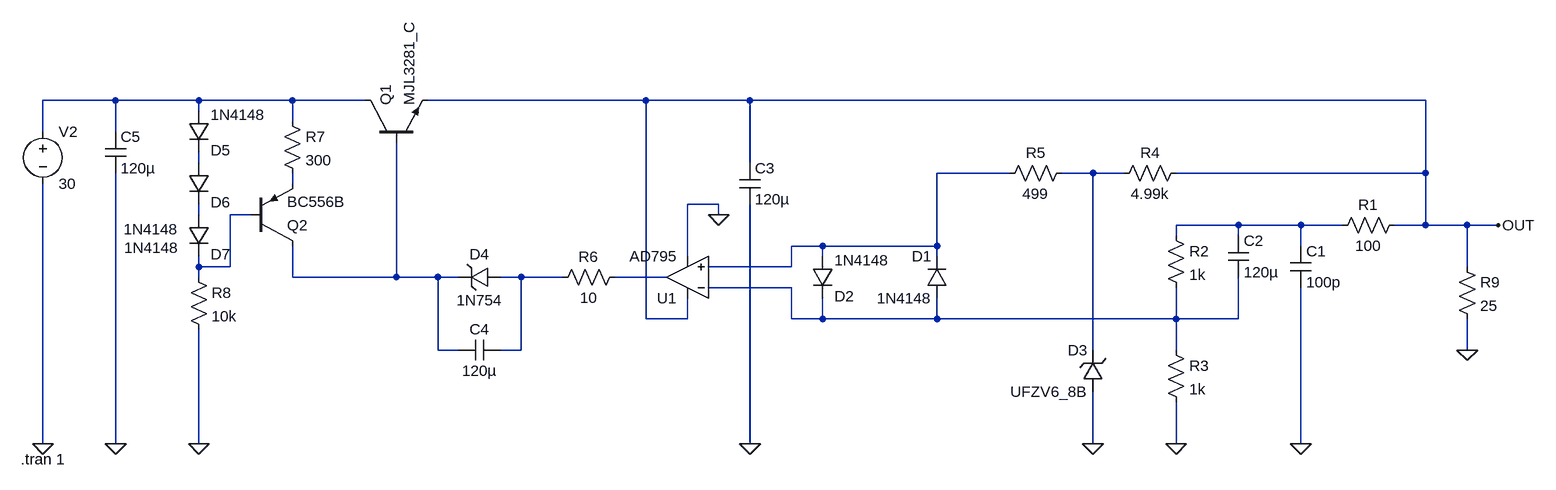
[diagram p0: schematic superreg.asc]
superreg.asc, the LTspice schematic file:
Version 4
SHEET 1 880 680
WIRE -1616 -96 -1728 -96
WIRE -1488 -96 -1616 -96
WIRE -1344 -96 -1488 -96
WIRE -1232 -96 -1344 -96
WIRE -800 -96 -1136 -96
WIRE -640 -96 -800 -96
WIRE 400 -96 -640 -96
WIRE -1488 -80 -1488 -96
WIRE -1344 -64 -1344 -96
WIRE -1728 -48 -1728 -96
WIRE -1616 -48 -1616 -96
WIRE -1488 0 -1488 -16
WIRE -640 0 -640 -96
WIRE -240 16 -352 16
WIRE -112 16 -160 16
WIRE -64 16 -112 16
WIRE 400 16 400 -96
WIRE 400 16 16 16
WIRE -1344 32 -1344 16
WIRE -688 64 -736 64
WIRE -1488 80 -1488 64
WIRE -1408 80 -1440 80
WIRE -688 80 -688 64
WIRE 112 96 16 96
WIRE 208 96 112 96
WIRE 272 96 208 96
WIRE 400 96 400 16
WIRE 400 96 352 96
WIRE 464 96 400 96
WIRE 512 96 464 96
WIRE 16 112 16 96
WIRE 112 112 112 96
WIRE -528 128 -576 128
WIRE -352 128 -352 16
WIRE -352 128 -528 128
WIRE 208 128 208 96
WIRE -736 144 -736 64
WIRE -528 144 -528 128
WIRE -352 144 -352 128
WIRE -1488 160 -1488 144
WIRE -1440 160 -1440 80
WIRE -1440 160 -1488 160
WIRE -576 160 -576 128
WIRE -576 160 -704 160
WIRE 464 160 464 96
WIRE -1488 176 -1488 160
WIRE -1344 176 -1344 128
WIRE -1184 176 -1184 -32
WIRE -1184 176 -1344 176
WIRE -1120 176 -1184 176
WIRE -1088 176 -1120 176
WIRE -992 176 -1024 176
WIRE -928 176 -992 176
WIRE -768 176 -848 176
WIRE -576 192 -704 192
WIRE -800 240 -800 -96
WIRE -736 240 -736 208
WIRE -736 240 -800 240
WIRE -576 240 -576 192
WIRE -528 240 -528 208
WIRE -528 240 -576 240
WIRE -352 240 -352 208
WIRE -352 240 -528 240
WIRE 16 240 16 192
WIRE 16 240 -352 240
WIRE 112 240 112 176
WIRE 112 240 16 240
WIRE -1120 288 -1120 176
WIRE -1088 288 -1120 288
WIRE -992 288 -992 176
WIRE -992 288 -1024 288
WIRE -112 288 -112 16
WIRE 16 288 16 240
WIRE 464 288 464 240
WIRE -1728 432 -1728 32
WIRE -1616 432 -1616 16
WIRE -1488 432 -1488 256
WIRE -640 432 -640 64
WIRE -112 432 -112 352
WIRE 16 432 16 368
WIRE 208 432 208 192
FLAG 208 432 0
FLAG 16 432 0
FLAG 512 96 OUT
FLAG -112 432 0
FLAG -640 432 0
FLAG -688 80 0
FLAG -1488 432 0
FLAG -1616 432 0
FLAG -1728 432 0
FLAG 464 288 0
SYMBOL res 368 80 R90
WINDOW 0 0 56 VBottom 2
WINDOW 3 32 56 VTop 2
SYMATTR InstName R1
SYMATTR Value 100
SYMBOL cap 192 128 R0
SYMATTR InstName C1
SYMATTR Value 100p
SYMBOL res 0 96 R0
SYMATTR InstName R2
SYMATTR Value 1k
SYMBOL cap 96 112 R0
SYMATTR InstName C2
SYMATTR Value 120µ
SYMBOL res 0 272 R0
SYMATTR InstName R3
SYMATTR Value 1k
SYMBOL res 32 0 R90
WINDOW 0 0 56 VBottom 2
WINDOW 3 32 56 VTop 2
SYMATTR InstName R4
SYMATTR Value 4.99k
SYMBOL res -144 0 R90
WINDOW 0 0 56 VBottom 2
WINDOW 3 32 56 VTop 2
SYMATTR InstName R5
SYMATTR Value 499
SYMBOL diode -336 208 R180
WINDOW 0 24 64 Left 2
WINDOW 3 24 0 Left 2
SYMATTR InstName D1
SYMATTR Value 1N4148
SYMBOL diode -544 144 R0
WINDOW 0 34 61 Left 2
WINDOW 3 34 6 Left 2
SYMATTR InstName D2
SYMATTR Value 1N4148
SYMBOL cap -656 0 R0
SYMATTR InstName C3
SYMATTR Value 120µ
SYMBOL res -832 160 R90
WINDOW 0 0 56 VBottom 2
WINDOW 3 32 56 VTop 2
SYMATTR InstName R6
SYMATTR Value 10
SYMBOL zener -96 352 R180
WINDOW 0 24 64 Left 2
WINDOW 3 24 0 Left 2
SYMATTR InstName D3
SYMATTR Value UFZV6_8B
SYMATTR Description Diode
SYMATTR Type diode
SYMBOL zener -1024 160 R90
WINDOW 0 -4 32 VBottom 2
WINDOW 3 36 32 VTop 2
SYMATTR InstName D4
SYMATTR Value 1N754
SYMATTR Description Diode
SYMATTR Type diode
SYMBOL cap -1024 272 R90
WINDOW 0 0 32 VBottom 2
WINDOW 3 32 32 VTop 2
SYMATTR InstName C4
SYMATTR Value 120µ
SYMBOL npn -1232 -32 R270
SYMATTR InstName Q1
SYMATTR Value MJL3281_C
SYMBOL res -1360 -80 R0
SYMATTR InstName R7
SYMATTR Value 300
SYMBOL pnp -1408 128 M180
SYMATTR InstName Q2
SYMATTR Value BC556B
SYMBOL res -1504 160 R0
SYMATTR InstName R8
SYMATTR Value 10k
SYMBOL cap -1632 -48 R0
SYMATTR InstName C5
SYMATTR Value 120µ
SYMBOL voltage -1728 -64 R0
WINDOW 123 0 0 Left 0
WINDOW 39 0 0 Left 0
SYMATTR InstName V2
SYMATTR Value 30
SYMBOL res 448 144 R0
SYMATTR InstName R9
SYMATTR Value 25
SYMBOL diode -1504 -80 R0
WINDOW 0 34 61 Left 2
WINDOW 3 34 6 Left 2
SYMATTR InstName D5
SYMATTR Value 1N4148
SYMBOL diode -1504 0 R0
WINDOW 0 34 61 Left 2
WINDOW 3 -100 102 Left 2
SYMATTR InstName D6
SYMATTR Value 1N4148
SYMBOL diode -1504 80 R0
WINDOW 0 34 61 Left 2
WINDOW 3 -99 51 Left 2
SYMATTR InstName D7
SYMATTR Value 1N4148
SYMBOL OpAmps\\AD795 -736 240 R180
SYMATTR InstName U1
TEXT -1762 456 Left 2 !.tran 1

The netlist it stands for:
* superreg.asc
R1 OUT N008 100
C1 N008 0 100p
R2 N008 N012 1k
C2 N008 N012 120µ
R3 N012 0 1k
R4 OUT N004 4.99k
R5 N004 N003 499
D1 N012 N003 1N4148
D2 N003 N012 1N4148
C3 OUT 0 120µ
R6 N011 N010 10
D3 0 N004 UFZV6_8B
D4 N010 N009 1N754
C4 N010 N009 120µ
Q1 N001 N009 OUT 0 MJL3281_C
R7 N001 N005 300
Q2 N009 N007 N005 0 BC556B
R8 N007 0 10k
C5 N001 0 120µ
V2 N001 0 30
R9 OUT 0 25
D5 N001 N002 1N4148
D6 N002 N006 1N4148
D7 N006 N007 1N4148
XU1 N003 N012 OUT 0 N011 AD795  ; pins In+ In- V+ V- OUT
.model D D
.lib standard.dio
.model NPN NPN
.model PNP PNP
.lib standard.bjt
.tran 1
.lib ADI1.lib
.backanno
.end